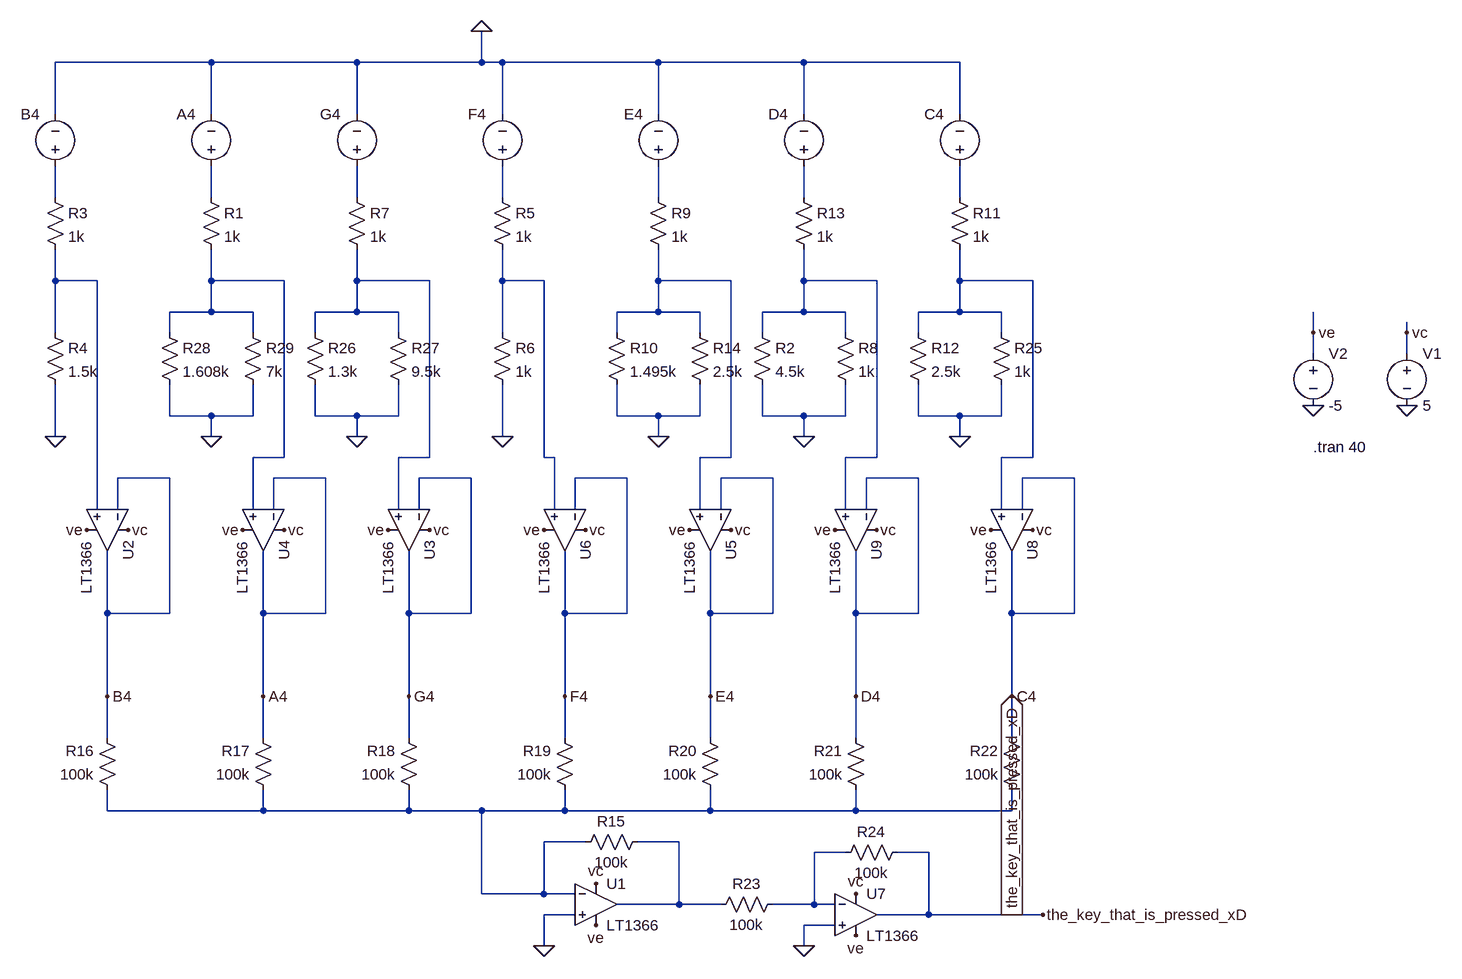
[diagram p0: schematic key_input_actually_finished.asc]
key_input_actually_finished.asc, the LTspice schematic file:
Version 4
SHEET 1 1096 1752
WIRE -800 48 -1040 48
WIRE -576 48 -800 48
WIRE -384 48 -384 0
WIRE -384 48 -576 48
WIRE -352 48 -384 48
WIRE -112 48 -352 48
WIRE 112 48 -112 48
WIRE 352 48 112 48
WIRE -1040 128 -1040 48
WIRE -800 128 -800 48
WIRE -576 128 -576 48
WIRE -352 128 -352 48
WIRE -112 128 -112 48
WIRE 112 128 112 48
WIRE 352 128 352 48
WIRE -1040 256 -1040 208
WIRE -800 256 -800 208
WIRE -576 256 -576 208
WIRE -352 256 -352 208
WIRE -112 256 -112 208
WIRE 112 256 112 208
WIRE 352 256 352 208
WIRE -1040 384 -1040 336
WIRE -976 384 -1040 384
WIRE -800 384 -800 336
WIRE -688 384 -800 384
WIRE -576 384 -576 336
WIRE -464 384 -576 384
WIRE -352 384 -352 336
WIRE -288 384 -352 384
WIRE -112 384 -112 336
WIRE 0 384 -112 384
WIRE 112 384 112 336
WIRE 224 384 112 384
WIRE 352 384 352 336
WIRE 464 384 352 384
WIRE -800 432 -800 384
WIRE -800 432 -864 432
WIRE -736 432 -800 432
WIRE -576 432 -576 384
WIRE -576 432 -640 432
WIRE -512 432 -576 432
WIRE -112 432 -112 384
WIRE -112 432 -176 432
WIRE -48 432 -112 432
WIRE 112 432 112 384
WIRE 112 432 48 432
WIRE 176 432 112 432
WIRE 352 432 352 384
WIRE 352 432 288 432
WIRE 416 432 352 432
WIRE -1040 464 -1040 384
WIRE -864 464 -864 432
WIRE -736 464 -736 432
WIRE -640 464 -640 432
WIRE -512 464 -512 432
WIRE -352 464 -352 384
WIRE -176 464 -176 432
WIRE -48 464 -48 432
WIRE 48 464 48 432
WIRE 176 464 176 432
WIRE 288 464 288 432
WIRE 416 464 416 432
WIRE 896 464 896 432
WIRE 1040 464 1040 448
WIRE 896 496 896 464
WIRE 1040 496 1040 464
WIRE -864 592 -864 544
WIRE -800 592 -864 592
WIRE -736 592 -736 544
WIRE -736 592 -800 592
WIRE -640 592 -640 544
WIRE -576 592 -640 592
WIRE -512 592 -512 544
WIRE -512 592 -576 592
WIRE -176 592 -176 544
WIRE -112 592 -176 592
WIRE -48 592 -48 544
WIRE -48 592 -112 592
WIRE 48 592 48 544
WIRE 112 592 48 592
WIRE 176 592 176 544
WIRE 176 592 112 592
WIRE 288 592 288 544
WIRE 352 592 288 592
WIRE 416 592 416 544
WIRE 416 592 352 592
WIRE -1040 624 -1040 544
WIRE -800 624 -800 592
WIRE -576 624 -576 592
WIRE -352 624 -352 544
WIRE -112 624 -112 592
WIRE 112 624 112 592
WIRE 352 624 352 592
WIRE -688 656 -688 384
WIRE -688 656 -736 656
WIRE -464 656 -464 384
WIRE -464 656 -512 656
WIRE -288 656 -288 384
WIRE -272 656 -288 656
WIRE 0 656 0 384
WIRE 0 656 -48 656
WIRE 224 656 224 384
WIRE 224 656 176 656
WIRE 464 656 464 384
WIRE 464 656 416 656
WIRE -864 688 -944 688
WIRE -624 688 -704 688
WIRE -400 688 -480 688
WIRE -160 688 -240 688
WIRE 64 688 -16 688
WIRE 288 688 208 688
WIRE 528 688 448 688
WIRE -976 736 -976 384
WIRE -944 736 -944 688
WIRE -736 736 -736 656
WIRE -704 736 -704 688
WIRE -512 736 -512 656
WIRE -480 736 -480 688
WIRE -272 736 -272 656
WIRE -240 736 -240 688
WIRE -48 736 -48 656
WIRE -16 736 -16 688
WIRE 176 736 176 656
WIRE 208 736 208 688
WIRE 416 736 416 656
WIRE 448 736 448 688
WIRE -960 896 -960 800
WIRE -864 896 -864 688
WIRE -864 896 -960 896
WIRE -720 896 -720 800
WIRE -624 896 -624 688
WIRE -624 896 -720 896
WIRE -496 896 -496 800
WIRE -400 896 -400 688
WIRE -400 896 -496 896
WIRE -256 896 -256 800
WIRE -160 896 -160 688
WIRE -160 896 -256 896
WIRE -32 896 -32 800
WIRE 64 896 64 688
WIRE 64 896 -32 896
WIRE 192 896 192 800
WIRE 288 896 288 688
WIRE 288 896 192 896
WIRE 432 896 432 800
WIRE 528 896 528 688
WIRE 528 896 432 896
WIRE -960 1024 -960 896
WIRE -720 1024 -720 896
WIRE -496 1024 -496 896
WIRE -256 1024 -256 896
WIRE -32 1024 -32 896
WIRE 192 1024 192 896
WIRE 432 1024 432 896
WIRE -960 1088 -960 1024
WIRE -720 1088 -720 1024
WIRE -496 1088 -496 1024
WIRE -256 1088 -256 1024
WIRE -32 1088 -32 1024
WIRE 192 1088 192 1024
WIRE 432 1088 432 1024
WIRE -960 1200 -960 1168
WIRE -720 1200 -720 1168
WIRE -720 1200 -960 1200
WIRE -496 1200 -496 1168
WIRE -496 1200 -720 1200
WIRE -384 1200 -496 1200
WIRE -256 1200 -256 1168
WIRE -256 1200 -384 1200
WIRE -32 1200 -32 1168
WIRE -32 1200 -256 1200
WIRE 192 1200 192 1168
WIRE 192 1200 -32 1200
WIRE 432 1200 432 1168
WIRE 432 1200 192 1200
WIRE -224 1248 -288 1248
WIRE -80 1248 -144 1248
WIRE 176 1264 128 1264
WIRE 304 1264 256 1264
WIRE -384 1328 -384 1200
WIRE -288 1328 -288 1248
WIRE -288 1328 -384 1328
WIRE -240 1328 -288 1328
WIRE -80 1344 -80 1248
WIRE -80 1344 -176 1344
WIRE -16 1344 -80 1344
WIRE 128 1344 128 1264
WIRE 128 1344 64 1344
WIRE 160 1344 128 1344
WIRE -240 1360 -288 1360
WIRE 304 1360 304 1264
WIRE 304 1360 224 1360
WIRE 432 1360 304 1360
WIRE 480 1360 432 1360
WIRE 160 1376 112 1376
WIRE -288 1408 -288 1360
WIRE 112 1408 112 1376
FLAG -384 0 0
FLAG 432 1024 C4
FLAG 192 1024 D4
FLAG -32 1024 E4
FLAG -256 1024 F4
FLAG -496 1024 G4
FLAG -720 1024 A4
FLAG -960 1024 B4
FLAG -288 1408 0
FLAG 1040 576 0
FLAG 1040 464 vc
FLAG 896 576 0
FLAG 896 464 ve
FLAG 464 768 vc
FLAG 224 768 vc
FLAG 0 768 vc
FLAG -224 768 vc
FLAG -464 768 vc
FLAG -688 768 vc
FLAG -928 768 vc
FLAG -208 1312 vc
FLAG 400 768 ve
FLAG 160 768 ve
FLAG -64 768 ve
FLAG -288 768 ve
FLAG -528 768 ve
FLAG -752 768 ve
FLAG -992 768 ve
FLAG -208 1376 ve
FLAG 112 1408 0
FLAG 192 1328 vc
FLAG 192 1392 ve
FLAG 480 1360 the_key_that_is_pressed_xD
FLAG 352 624 0
FLAG 112 624 0
FLAG -112 624 0
FLAG -576 624 0
FLAG -800 624 0
FLAG -1040 624 0
FLAG -352 624 0
FLAG 432 1360 the_key_that_is_pressed_xD
IOPIN 432 1360 Out
SYMBOL res -816 240 R0
SYMATTR InstName R1
SYMATTR Value 1k
SYMBOL res -1056 240 R0
SYMATTR InstName R3
SYMATTR Value 1k
SYMBOL res -1056 448 R0
SYMATTR InstName R4
SYMATTR Value 1.5k
SYMBOL res -368 240 R0
SYMATTR InstName R5
SYMATTR Value 1k
SYMBOL res -368 448 R0
SYMATTR InstName R6
SYMATTR Value 1k
SYMBOL res -592 240 R0
SYMATTR InstName R7
SYMATTR Value 1k
SYMBOL res -128 240 R0
SYMATTR InstName R9
SYMATTR Value 1k
SYMBOL res 336 240 R0
SYMATTR InstName R11
SYMATTR Value 1k
SYMBOL res 96 240 R0
SYMATTR InstName R13
SYMATTR Value 1k
SYMBOL voltage -1040 224 R180
WINDOW 0 24 96 Left 2
WINDOW 3 24 16 Invisible 2
WINDOW 123 0 0 Left 0
WINDOW 39 0 0 Left 0
SYMATTR InstName B4
SYMATTR Value PWL(30.499999999999 0 30.5 5 35 5 35.00000000001 0)
SYMBOL voltage -800 224 R180
WINDOW 0 24 96 Left 2
WINDOW 3 24 16 Invisible 2
WINDOW 123 0 0 Left 0
WINDOW 39 0 0 Left 0
SYMATTR InstName A4
SYMATTR Value PWL(25.499999999999 0 25.5 5 30 5 30.00000000000001 0)
SYMBOL voltage -576 224 R180
WINDOW 0 24 96 Left 2
WINDOW 3 24 68 Invisible 2
WINDOW 123 0 0 Left 0
WINDOW 39 0 0 Left 0
SYMATTR InstName G4
SYMATTR Value PWL(20.499999999999 0 20.5 5 25 5 25.0000000001 0)
SYMBOL voltage -352 224 R180
WINDOW 0 24 96 Left 2
WINDOW 3 24 68 Invisible 2
WINDOW 123 0 0 Left 0
WINDOW 39 0 0 Left 0
SYMATTR InstName F4
SYMATTR Value PWL(15.499999999999 0 15.5 5 20 5 20.00000001 0)
SYMBOL voltage -112 224 R180
WINDOW 0 24 96 Left 2
WINDOW 3 24 68 Invisible 2
WINDOW 123 0 0 Left 0
WINDOW 39 0 0 Left 0
SYMATTR InstName E4
SYMATTR Value PWL(10.499999999999 0 10.5 5 15 5 15.00000001 0)
SYMBOL voltage 112 224 R180
WINDOW 0 24 96 Left 2
WINDOW 3 24 68 Invisible 2
WINDOW 123 0 0 Left 0
WINDOW 39 0 0 Left 0
SYMATTR InstName D4
SYMATTR Value PWL(5.499999999999 0 5.5 5 10 5 10.000001 0)
SYMBOL voltage 352 224 R180
WINDOW 0 24 96 Left 2
WINDOW 3 24 68 Invisible 2
WINDOW 123 0 0 Left 0
WINDOW 39 0 0 Left 0
SYMATTR InstName C4
SYMATTR Value PWL(0 0 0.049999999999 0 0.05 5 5 5 5.00000001 0)
SYMBOL LT1366 -208 1280 R0
SYMATTR InstName U1
SYMBOL res -128 1232 R90
WINDOW 0 0 56 VBottom 2
WINDOW 3 32 56 VTop 2
SYMATTR InstName R15
SYMATTR Value 100k
SYMBOL res -944 1184 R180
WINDOW 0 36 76 Left 2
WINDOW 3 36 40 Left 2
SYMATTR InstName R16
SYMATTR Value 100k
SYMBOL res -704 1184 R180
WINDOW 0 36 76 Left 2
WINDOW 3 36 40 Left 2
SYMATTR InstName R17
SYMATTR Value 100k
SYMBOL res -480 1184 R180
WINDOW 0 36 76 Left 2
WINDOW 3 36 40 Left 2
SYMATTR InstName R18
SYMATTR Value 100k
SYMBOL res -240 1184 R180
WINDOW 0 36 76 Left 2
WINDOW 3 36 40 Left 2
SYMATTR InstName R19
SYMATTR Value 100k
SYMBOL res -16 1184 R180
WINDOW 0 36 76 Left 2
WINDOW 3 36 40 Left 2
SYMATTR InstName R20
SYMATTR Value 100k
SYMBOL res 208 1184 R180
WINDOW 0 36 76 Left 2
WINDOW 3 36 40 Left 2
SYMATTR InstName R21
SYMATTR Value 100k
SYMBOL res 448 1184 R180
WINDOW 0 36 76 Left 2
WINDOW 3 36 40 Left 2
SYMATTR InstName R22
SYMATTR Value 100k
SYMBOL LT1366 -432 768 R90
SYMATTR InstName U3
SYMBOL LT1366 -896 768 R90
SYMATTR InstName U2
SYMBOL LT1366 -656 768 R90
SYMATTR InstName U4
SYMBOL LT1366 32 768 R90
SYMATTR InstName U5
SYMBOL LT1366 -192 768 R90
SYMATTR InstName U6
SYMBOL LT1366 496 768 R90
SYMATTR InstName U8
SYMBOL LT1366 256 768 R90
SYMATTR InstName U9
SYMBOL voltage 1040 480 R0
SYMATTR InstName V1
SYMATTR Value 5
SYMBOL voltage 896 480 R0
SYMATTR InstName V2
SYMATTR Value -5
SYMBOL LT1366 192 1296 R0
SYMATTR InstName U7
SYMBOL res 80 1328 R90
WINDOW 0 0 56 VBottom 2
WINDOW 3 32 56 VTop 2
SYMATTR InstName R23
SYMATTR Value 100k
SYMBOL res 272 1248 R90
WINDOW 0 0 56 VBottom 2
WINDOW 3 32 56 VTop 2
SYMATTR InstName R24
SYMATTR Value 100k
SYMBOL res 272 448 R0
SYMATTR InstName R12
SYMATTR Value 2.5k
SYMBOL res 400 448 R0
SYMATTR InstName R25
SYMATTR Value 1k
SYMBOL res 32 448 R0
SYMATTR InstName R2
SYMATTR Value 4.5k
SYMBOL res 160 448 R0
SYMATTR InstName R8
SYMATTR Value 1k
SYMBOL res -192 448 R0
SYMATTR InstName R10
SYMATTR Value 1.495k
SYMBOL res -64 448 R0
SYMATTR InstName R14
SYMATTR Value 2.5k
SYMBOL res -656 448 R0
SYMATTR InstName R26
SYMATTR Value 1.3k
SYMBOL res -528 448 R0
SYMATTR InstName R27
SYMATTR Value 9.5k
SYMBOL res -880 448 R0
SYMATTR InstName R28
SYMATTR Value 1.608k
SYMBOL res -752 448 R0
SYMATTR InstName R29
SYMATTR Value 7k
TEXT 896 640 Left 2 !.tran 40

The netlist it stands for:
* key_input_actually_finished.asc
R1 N002 N009 1k
R3 N001 N008 1k
R4 N008 0 1.5k
R5 N004 N011 1k
R6 N011 0 1k
R7 N003 N010 1k
R9 N005 N012 1k
R11 N007 N014 1k
R13 N006 N013 1k
V§B4 N001 0 PWL(30.499999999999 0 30.5 5 35 5 35.00000000001 0)
V§A4 N002 0 PWL(25.499999999999 0 25.5 5 30 5 30.00000000000001 0)
V§G4 N003 0 PWL(20.499999999999 0 20.5 5 25 5 25.0000000001 0)
V§F4 N004 0 PWL(15.499999999999 0 15.5 5 20 5 20.00000001 0)
V§E4 N005 0 PWL(10.499999999999 0 10.5 5 15 5 15.00000001 0)
V§D4 N006 0 PWL(5.499999999999 0 5.5 5 10 5 10.000001 0)
V§C4 N007 0 PWL(0 0 0.049999999999 0 0.05 5 5 5 5.00000001 0)
XU1 0 N015 vc ve N016 LT1366  ; pins In+ In- V+ V- OUT
R15 N016 N015 100k
R16 N015 B4 100k
R17 N015 A4 100k
R18 N015 G4 100k
R19 N015 F4 100k
R20 N015 E4 100k
R21 N015 D4 100k
R22 N015 C4 100k
XU3 N010 G4 vc ve G4 LT1366  ; pins In+ In- V+ V- OUT
XU2 N008 B4 vc ve B4 LT1366  ; pins In+ In- V+ V- OUT
XU4 N009 A4 vc ve A4 LT1366  ; pins In+ In- V+ V- OUT
XU5 N012 E4 vc ve E4 LT1366  ; pins In+ In- V+ V- OUT
XU6 N011 F4 vc ve F4 LT1366  ; pins In+ In- V+ V- OUT
XU8 N014 C4 vc ve C4 LT1366  ; pins In+ In- V+ V- OUT
XU9 N013 D4 vc ve D4 LT1366  ; pins In+ In- V+ V- OUT
V1 vc 0 5
V2 ve 0 -5
XU7 0 N017 vc ve the_key_that_is_pressed_xD LT1366  ; pins In+ In- V+ V- OUT
R23 N017 N016 100k
R24 the_key_that_is_pressed_xD N017 100k
R12 N014 0 2.5k
R25 N014 0 1k
R2 N013 0 4.5k
R8 N013 0 1k
R10 N012 0 1.495k
R14 N012 0 2.5k
R26 N010 0 1.3k
R27 N010 0 9.5k
R28 N009 0 1.608k
R29 N009 0 7k
.tran 40
.lib LTC.lib
.backanno
.end